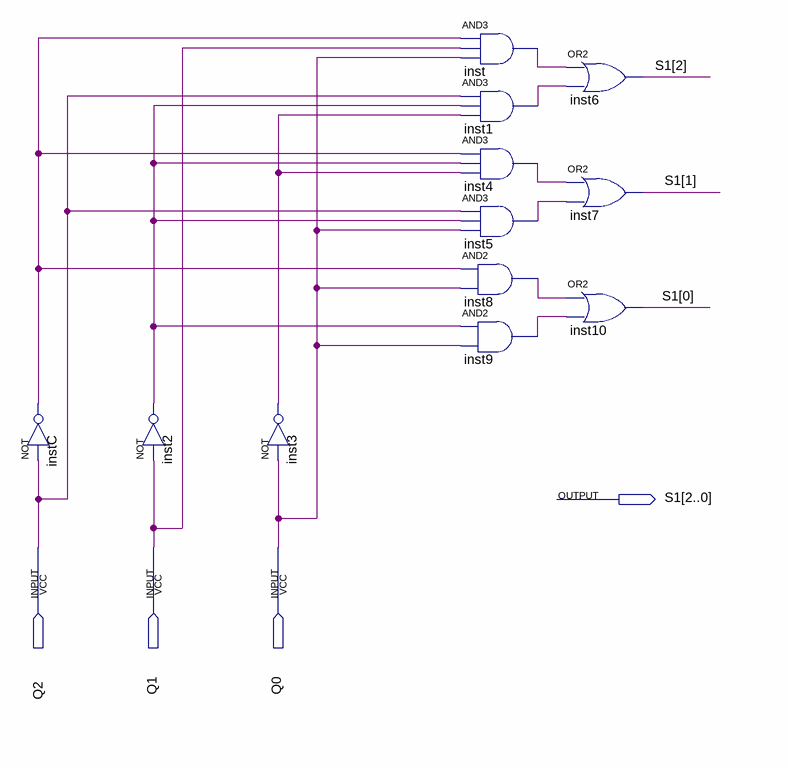
[diagram p0: schematic sheet]
// Quartus schematic S1_C1.bdf as structural Verilog: 12 symbols, 4 pins
module S1_C1 (
  input  Q2,
  input  Q1,
  input  Q0,
  output [2:0] S1
);

  wire inst1_out, inst2_out, inst3_out, inst4_out, inst5_out, inst8_out, inst9_out, inst_out, instC_out;

  not instC (instC_out, Q2);
  not inst2 (inst2_out, Q1);
  not inst3 (inst3_out, Q0);
  and inst (inst_out, instC_out, Q1, Q0);
  and inst1 (inst1_out, Q2, inst2_out, inst3_out);
  and inst4 (inst4_out, instC_out, inst2_out, inst3_out);
  and inst5 (inst5_out, Q2, inst2_out, Q0);
  and inst8 (inst8_out, instC_out, Q0);
  and inst9 (inst9_out, inst2_out, Q0);
  or inst6 (S1[2], inst_out, inst1_out);
  or inst7 (S1[1], inst4_out, inst5_out);
  or inst10 (S1[0], inst8_out, inst9_out);
endmodule
